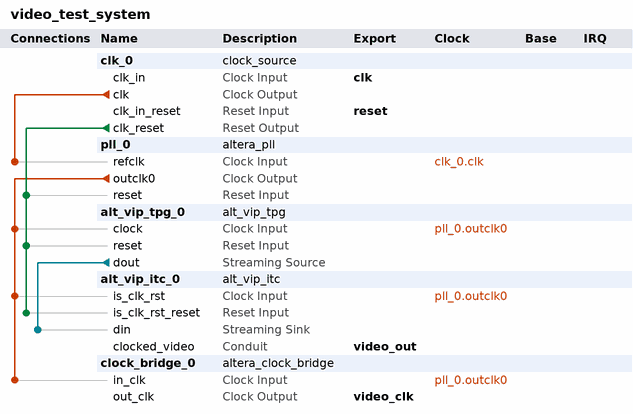
[diagram p0: system contents]
# Platform Designer (Qsys) system video_test_system, Cyclone V 5CSXFC6C6U23C6
# Parameters at their usual value, and those the tool derives, are not listed.
package require -exact qsys 14.0
create_system video_test_system
set_project_property DEVICE_FAMILY {Cyclone V}
set_project_property DEVICE 5CSXFC6C6U23C6

add_instance clk_0 clock_source 14.0
set_instance_parameter_value clk_0 clockFrequency 25000000

add_instance pll_0 altera_pll 14.0
set_instance_parameter_value pll_0 gui_device_speed_grade 7
set_instance_parameter_value pll_0 gui_pll_mode {Integer-N PLL}
set_instance_parameter_value pll_0 gui_reference_clock_frequency 25.0
set_instance_parameter_value pll_0 gui_operation_mode direct
set_instance_parameter_value pll_0 gui_use_locked true
set_instance_parameter_value pll_0 gui_number_of_clocks 1
set_instance_parameter_value pll_0 gui_output_clock_frequency0 40.0

add_instance alt_vip_tpg_0 alt_vip_tpg 13.1
set_instance_parameter_value alt_vip_tpg_0 CHANNELS_IN_PAR 3
set_instance_parameter_value alt_vip_tpg_0 CTRL_INTERFACE_DEPTH 10
set_instance_parameter_value alt_vip_tpg_0 PARAMETERISATION {<testPatternGeneratorParams><TPG_NAME>MyPatternGenerator</TPG_NAME><TPG_RUNTIME_CONTROL>0</TPG_RUNTIME_CONTROL><TPG_BPS>8</TPG_BPS><TPG_MAX_WIDTH>800</TPG_MAX_WIDTH><TPG_MAX_HEIGHT>600</TPG_MAX_HEIGHT><TPG_COLORSPACE>COLORSPACE_RGB</TPG_COLORSPACE><TPG_FORMAT>SAMPLE_444</TPG_FORMAT><TPG_INTERLACE>PROGRESSIVE_FRAMES</TPG_INTERLACE><TPG_PARALLEL_MODE>true</TPG_PARALLEL_MODE><TPG_PATTERN>TPG_PATTERN_COLORBARS</TPG_PATTERN><TPG_UNIFORM_VAL_C1>128</TPG_UNIFORM_VAL_C1><TPG_UNIFORM_VAL_C2>128</TPG_UNIFORM_VAL_C2><TPG_UNIFORM_VAL_C3>128</TPG_UNIFORM_VAL_C3></testPatternGeneratorParams>}

add_instance alt_vip_itc_0 alt_vip_itc 14.0
set_instance_parameter_value alt_vip_itc_0 NUMBER_OF_COLOUR_PLANES 3
set_instance_parameter_value alt_vip_itc_0 H_ACTIVE_PIXELS 800
set_instance_parameter_value alt_vip_itc_0 V_ACTIVE_LINES 600
set_instance_parameter_value alt_vip_itc_0 FIFO_DEPTH 1920
set_instance_parameter_value alt_vip_itc_0 CLOCKS_ARE_SAME 1
set_instance_parameter_value alt_vip_itc_0 THRESHOLD 1919
set_instance_parameter_value alt_vip_itc_0 H_SYNC_LENGTH 128
set_instance_parameter_value alt_vip_itc_0 H_FRONT_PORCH 40
set_instance_parameter_value alt_vip_itc_0 H_BACK_PORCH 88
set_instance_parameter_value alt_vip_itc_0 V_SYNC_LENGTH 4
set_instance_parameter_value alt_vip_itc_0 V_FRONT_PORCH 1
set_instance_parameter_value alt_vip_itc_0 V_BACK_PORCH 23

add_instance clock_bridge_0 altera_clock_bridge 14.0
set_instance_parameter_value clock_bridge_0 DERIVED_CLOCK_RATE 40000000
set_instance_parameter_value clock_bridge_0 EXPLICIT_CLOCK_RATE 0

# connections
add_connection clk_0.clk pll_0.refclk clock
add_connection pll_0.outclk0 alt_vip_itc_0.is_clk_rst clock
add_connection pll_0.outclk0 alt_vip_tpg_0.clock clock
add_connection pll_0.outclk0 clock_bridge_0.in_clk clock
add_connection clk_0.clk_reset alt_vip_itc_0.is_clk_rst_reset reset
add_connection clk_0.clk_reset alt_vip_tpg_0.reset reset
add_connection clk_0.clk_reset pll_0.reset reset
add_connection alt_vip_tpg_0.dout alt_vip_itc_0.din avalon_streaming

# exported interfaces
add_interface clk clock sink
set_interface_property clk EXPORT_OF clk_0.clk_in
add_interface reset reset sink
set_interface_property reset EXPORT_OF clk_0.clk_in_reset
add_interface video_out conduit end
set_interface_property video_out EXPORT_OF alt_vip_itc_0.clocked_video
add_interface video_clk clock source
set_interface_property video_clk EXPORT_OF clock_bridge_0.out_clk

set_interconnect_requirement {$system} qsys_mm.clockCrossingAdapter HANDSHAKE
set_interconnect_requirement {$system} qsys_mm.maxAdditionalLatency 1
set_interconnect_requirement {$system} qsys_mm.insertDefaultSlave FALSE

save_system video_test_system.qsys
